# Altium schematic sheet INV.Main.SchDoc (part 2 of 2)
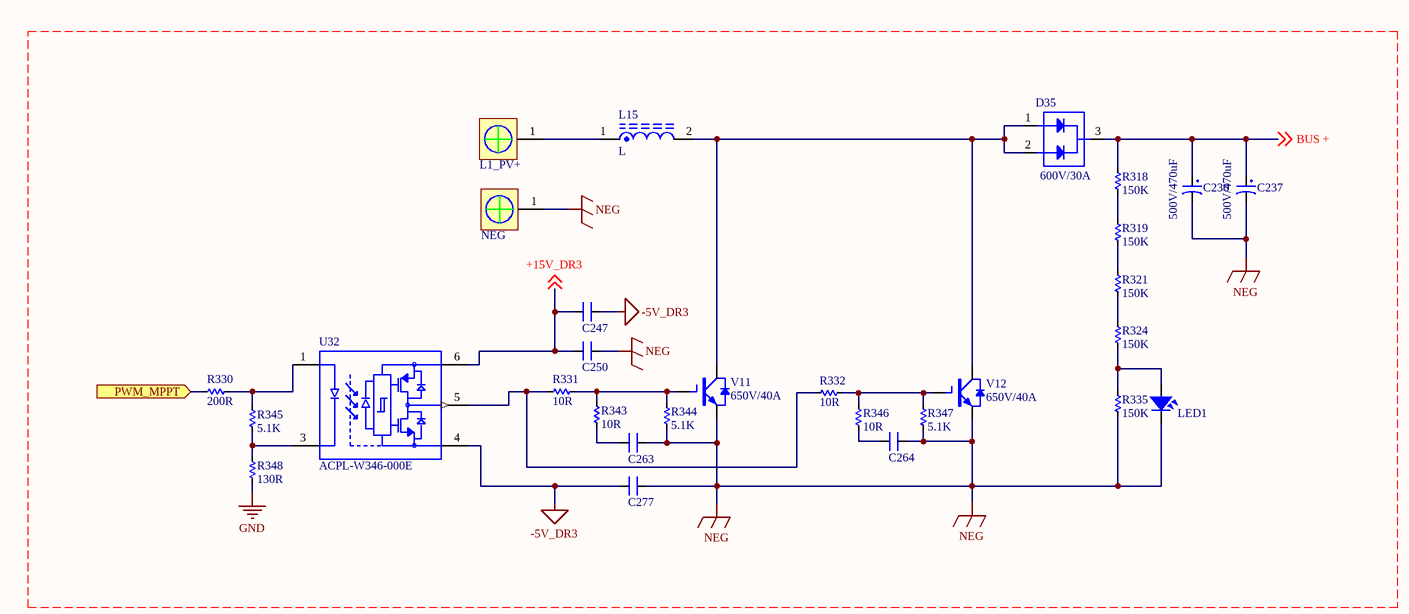
[diagram p8: INV.Main.SchDoc, bottom column 4 of 4]

## Library data of the parts
2 3 *19-*21 *26 *29 H3 H4 PV_+2-PV_+4 = Copper
BT1 T5 = Tranfomer EE13: Designed by: VanDungEvn; Value: BAX
C94-C99 C101-C106 C109-C125 C127-C139 C141-C156 C161-C168 C170-C199 C202-C205 C224 C227 C232-C234 C247-C250 C257 C258 C263 C264 C277 = CAP-SMD: Value: 33pF
C100 = CAP C3D 35x46x35mm: capacitor E256238; MP: ECWFG2J475KA; MF: Panasonic; Value: *; Price: None; Package: MOLDED-2 Panasonic; Availability: In Stock; Check_prices: https://www.snapeda.com/parts/ECWFG2J475KA/Panasonic/view-part/?ref=eda; SnapEDA_Link: https://www.snapeda.com/parts/ECWFG2J475KA/Panasonic/view-part/?ref=snap
C107 C108 C225 C226 C231 C235-C237 = Cap - 10x18 - N: Cắm; Don_Vi: Con; So_Chan: 2; Ten_Linh_Kien: Tụ Hóa 220uF 10V 6x11MM; Ma_Hang: MH004510; Chung_Loai: Cắm; Kieu_Chan: *
C126 C206 C296 = CAP N5-1n/500V: Metallized Polypropylene Film Capacitor; MP: ECWFG2J475KA; MF: Panasonic; Value: *; Price: None; Package: MOLDED-2 Panasonic; Availability: In Stock; Check_prices: https://www.snapeda.com/parts/ECWFG2J475KA/Panasonic/view-part/?ref=eda; SnapEDA_Link: https://www.snapeda.com/parts/ECWFG2J475KA/Panasonic/view-part/?ref=snap
C140 C200 C201 C209 C211-C218 C220-C223 C228-C230 C238 C240-C246 C251 C253-C256 C259-C261 C278 C280-C283 C285-C287 C290 C292-C295 C297-C300 C302-C308 = Tu dan gom: Tu khong phan cuc; Value: 0.47uF
C157-C160 = ECWFG2J475KA: Metallized Polypropylene Film Capacitor; MF: Panasonic; Value: *; Price: None; Package: MOLDED-2 Panasonic; MP: ECWFG2J475KA; Availability: In Stock; Check_prices: https://www.snapeda.com/parts/ECWFG2J475KA/Panasonic/view-part/?ref=eda; SnapEDA_Link: https://www.snapeda.com/parts/ECWFG2J475KA/Panasonic/view-part/?ref=snap
C169 = CAP X2 B32824: CAP X2 B32924; MP: ECWFG2J475KA; MF: Panasonic; Value: *; Price: None; Package: MOLDED-2 Panasonic; Availability: In Stock; Check_prices: https://www.snapeda.com/parts/ECWFG2J475KA/Panasonic/view-part/?ref=eda; SnapEDA_Link: https://www.snapeda.com/parts/ECWFG2J475KA/Panasonic/view-part/?ref=snap
C207 C208 = Cap an toan: Metallized Polypropylene Film Capacitor; MP: ECWFG2J475KA; MF: Panasonic; Value: *; Price: None; Package: MOLDED-2 Panasonic; Availability: In Stock; Check_prices: https://www.snapeda.com/parts/ECWFG2J475KA/Panasonic/view-part/?ref=eda; SnapEDA_Link: https://www.snapeda.com/parts/ECWFG2J475KA/Panasonic/view-part/?ref=snap
C210 C219 C239 C252 C279 C291 C301 = Cap - 10x18 - N: Cắm 100uF 25V; Don_Vi: Con; So_Chan: 2; Ten_Linh_Kien: Tụ Hóa 220uF 10V 6x11MM; Ma_Hang: MH004510; Chung_Loai: Cắm; Kieu_Chan: *
C262 C284 C288 C289 = CC0603JRNPO9BN910: CAP CER 91PF 50V 5% COG/NPO 0603; Solder: SMT; CompanyID: VT-01341; Value: 91pF/50V; MPN: CC0603JRNPO9BN910; Category: CAPACITOR; PinCount: 2
C265-C276 = CC0603JRNPO9BN910: Cap Film; Solder: SMT; CompanyID: VT-01341; Value: 91pF/50V; MPN: CC0603JRNPO9BN910; Category: CAPACITOR; PinCount: 2
CE1 CE2 = CAP-ALU-DIP: 6x14mm; Published: 8-Jun-2000; LatestRevisionDate: 17-Jul-2002; LatestRevisionNote: Re-released for DXP Platform.; PackageReference: POLAR0.8; Publisher: Altium Limited
D28 D30-D34 D37-D40 D42-D44 = DIODE: Diode 600V 2A thay the ES2J; Value: 1N4007
D29 = Diode Double: 200V/5A TO-252 MURD520; MP: STTH2003CG-TR; Package: None; Price: None; Value: *; Availability: Unavailable
D35 = Diode Double: 600V/30A STTH30AC06 TO3P-3L; MP: STTH2003CG-TR; Package: None; Price: None; Value: *; Availability: Unavailable
D36 = Diode Double: MP: STTH2003CG-TR; Package: None; Price: None; Value: *; Availability: Unavailable
D41 = Diode Double: STTH2003 Series Dual 10 A 1 V 35 ns Secondary Rectifier Surface Mount - D2PAK; MP: STTH2003CG-TR; Package: None; Price: None; Value: *; Availability: Unavailable
FB1 FB2 = RC0603FR-0775RL: RES SMD 75 OHM 1% 1/10W 0603; Solder: SMT; Value: 75R; MPN: RC0603FR-0775RL; Category: RESISTOR; PinCount: 2
J1 = Header 25x2: Header, 25x2-Pin 2.5mm; LatestRevisionDate: 17-Jul-2002; LatestRevisionNote: Re-released for DXP Platform.; Publisher: Altium Limited
J2 J3 = Header 15x2: Header, 15x2-Pin 2.5mm; LatestRevisionDate: 17-Jul-2002; LatestRevisionNote: Re-released for DXP Platform.; Publisher: Altium Limited
J6 NTC1 NTC2 = Jump2
L12 = LBOSHOG-V1: Cuận cảm bộ sạc PWM Hybrid; Value: Loc 220; Designed by: VanDungEvn
L13 = LSINEOG-V1: Cuận cảm bộ sạc PWM Hybrid; Value: Loc 220; Designed by: VanDungEvn
L14 = Bien ap dong: Biến áp đo dòng; Value: Loc 220; Designed by: VanDungEvn
L15 = LBOSPVOG-V1: Cuận cảm bộ sạc PWM Hybrid; Value: Loc 220; Designed by: VanDungEvn
L16 = LBATOG-V1: Cuận cảm bộ sạc PWM Hybrid; Value: Loc 220; Designed by: VanDungEvn
LED1 = LED1-SMD: Value: LED 3 - 5 ly 2 Colour
P2 = Header 4P 2.54 Duc Thang: Cắm; Ten_Linh_Kien: Header 4P XH2.54-4P Đực Thẳng; Don_Vi: Con; Ma_Hang: MH001285; Chung_Loai: Cắm
Q6 Q9 Q18 Q19 = D882M: NPN 40V/2A PBSS4240T
Q7 Q8 Q14 Q15 = D882M: thay the D882
Q10 Q13 Q20 Q21 = B772M-PNP: PNP 40V/2A PBSS5240T; Value: C9015
Q11 Q12 Q16 Q17 = B772M-PNP: thay the B772; Value: C9015
QH1-QH4 = FGA25N120ANTD: IGBT NPT IKW50N65EH5 thay the xang IKW50N65ET7; MF: ON Semiconductor; Value: *; Digi-Key_Purchase_URL: https://www.digikey.in/product-detail/en/on-semiconductor/FGA25N120ANTDTU/FGA25N120ANTDTU-ND/820640?utm_source=snapeda&utm_medium=aggregator&utm_campaign=symbol; MP: FGA25N120ANTD; Package: TO-3 Fairchild Semiconductor; SnapEDA_Link: https://www.snapeda.com/parts/FGA25N120ANTD/ON%20Semiconductor/view-part/202622/?ref=snap; Digi-Key_Part_Number: FGA25N120ANTDTU-ND
QL1-QL4 = MOSFET IRF N: N-channel mosfet IRFP4468PBF; Value: IRF840
R149 R150 R159 R160 R169 R170 R175 R176 R181-R240 R245-R248 R250-R252 R258-R309 R316 R322 R323 R325-R334 R343-R350 = Res-SMD: 0805; Manufacturer: Generic Components; Class: Passive; Published: 08/06/2000; Publisher: Altium Hobart Technology Centre
R151-R158 R161-R168 R171-R174 R177-R180 R241-R244 R253-R256 R310-R313 = Res-SMD: 1206; Manufacturer: Generic Components; Class: Passive; Published: 08/06/2000; Publisher: Altium Hobart Technology Centre
R249 R257 R314 R315 R320 R336-R342 R351-R361 = R dan: Resistor 0805; Manufacturer: Generic Components; Class: Passive; Published: 08/06/2000; Publisher: Altium Hobart Technology Centre
R317-R319 R321 R324 R335 = Res-SMD: 1210 EX; Manufacturer: Generic Components; Class: Passive; Published: 08/06/2000; Publisher: Altium Hobart Technology Centre
T3 = Transfomer PM62: Biến áp xung 5KW PM62/44; MP: 14A-10R-10; Package: None; Price: None; Value: *; Availability: Unavailable
T4 = Transfomer EE28: MP: 14A-10R-10; Package: None; Price: None; Value: *; Availability: Unavailable
U11 U18 = Current sensor: Bien dong sinomags STB-CAS/R; Value: Loc 220; Designed by: VanDungEvn
U12-U17 U19-U28 U32 = ACPL-W346-000E: 2.5A Gate Driver Optical Coupling 5000Vrms 1 Channel 6-SO Stretched; MF: Broadcom Limited; Package: SOIC-6 Broadcom; Availability: Unavailable; MP: ACPL-W346-000E; Value: *; SnapEDA_Link: https://www.snapeda.com/parts/ACPL-W346-000E/Broadcom%20Limited/view-part/2767622/?ref=snap; Price: None
U29 = LM358 SOP8: Dán; Ma_Hang: MH000609; Don_Vi: Con; Ten_Linh_Kien: LM358 SOP8; Kieu_Chan: *; Ghi_Chu: *; Chung_Loai: Dán
U30 = LM358N/NOPB: MF: Texas Instruments; SnapEDA_Link: https://www.snapeda.com/parts/LM358N/NOPB/Texas+Instruments/view-part/?ref=snap; Package: PDIP-8 Texas; MP: LM358N/NOPB; Check_prices: https://www.snapeda.com/parts/LM358N/NOPB/Texas+Instruments/view-part/?ref=eda; Purchase-URL: https://pricing.snapeda.com/search/part/LM358N/NOPB/?ref=eda; Price: None; Value: *; Availability: In Stock
U31 = VOM617A-2T: OPTOISOLATOR 3.75KV TRANS 4-SOP; Solder: SMT; CompanyID: VT-xxxx; MPN: VOM617A-2T; Value: VOM617A-2T
V3 V6 V11 V12 = FGA25N120ANTD: IGBT NPT G40H65DFB ST; MF: ON Semiconductor; Value: *; Digi-Key_Purchase_URL: https://www.digikey.in/product-detail/en/on-semiconductor/FGA25N120ANTDTU/FGA25N120ANTDTU-ND/820640?utm_source=snapeda&utm_medium=aggregator&utm_campaign=symbol; MP: FGA25N120ANTD; Package: TO-3 Fairchild Semiconductor; SnapEDA_Link: https://www.snapeda.com/parts/FGA25N120ANTD/ON%20Semiconductor/view-part/202622/?ref=snap; Digi-Key_Part_Number: FGA25N120ANTDTU-ND
V4 V5 V7-V10 = FGA25N120ANTD: IGBT NPT STGWA80H65DFB; MF: ON Semiconductor; Value: *; Digi-Key_Purchase_URL: https://www.digikey.in/product-detail/en/on-semiconductor/FGA25N120ANTDTU/FGA25N120ANTDTU-ND/820640?utm_source=snapeda&utm_medium=aggregator&utm_campaign=symbol; MP: FGA25N120ANTD; Package: TO-3 Fairchild Semiconductor; SnapEDA_Link: https://www.snapeda.com/parts/FGA25N120ANTD/ON%20Semiconductor/view-part/202622/?ref=snap; Digi-Key_Part_Number: FGA25N120ANTDTU-ND